# EAGLE design hbridge2 (EAGLE 7.1.0)
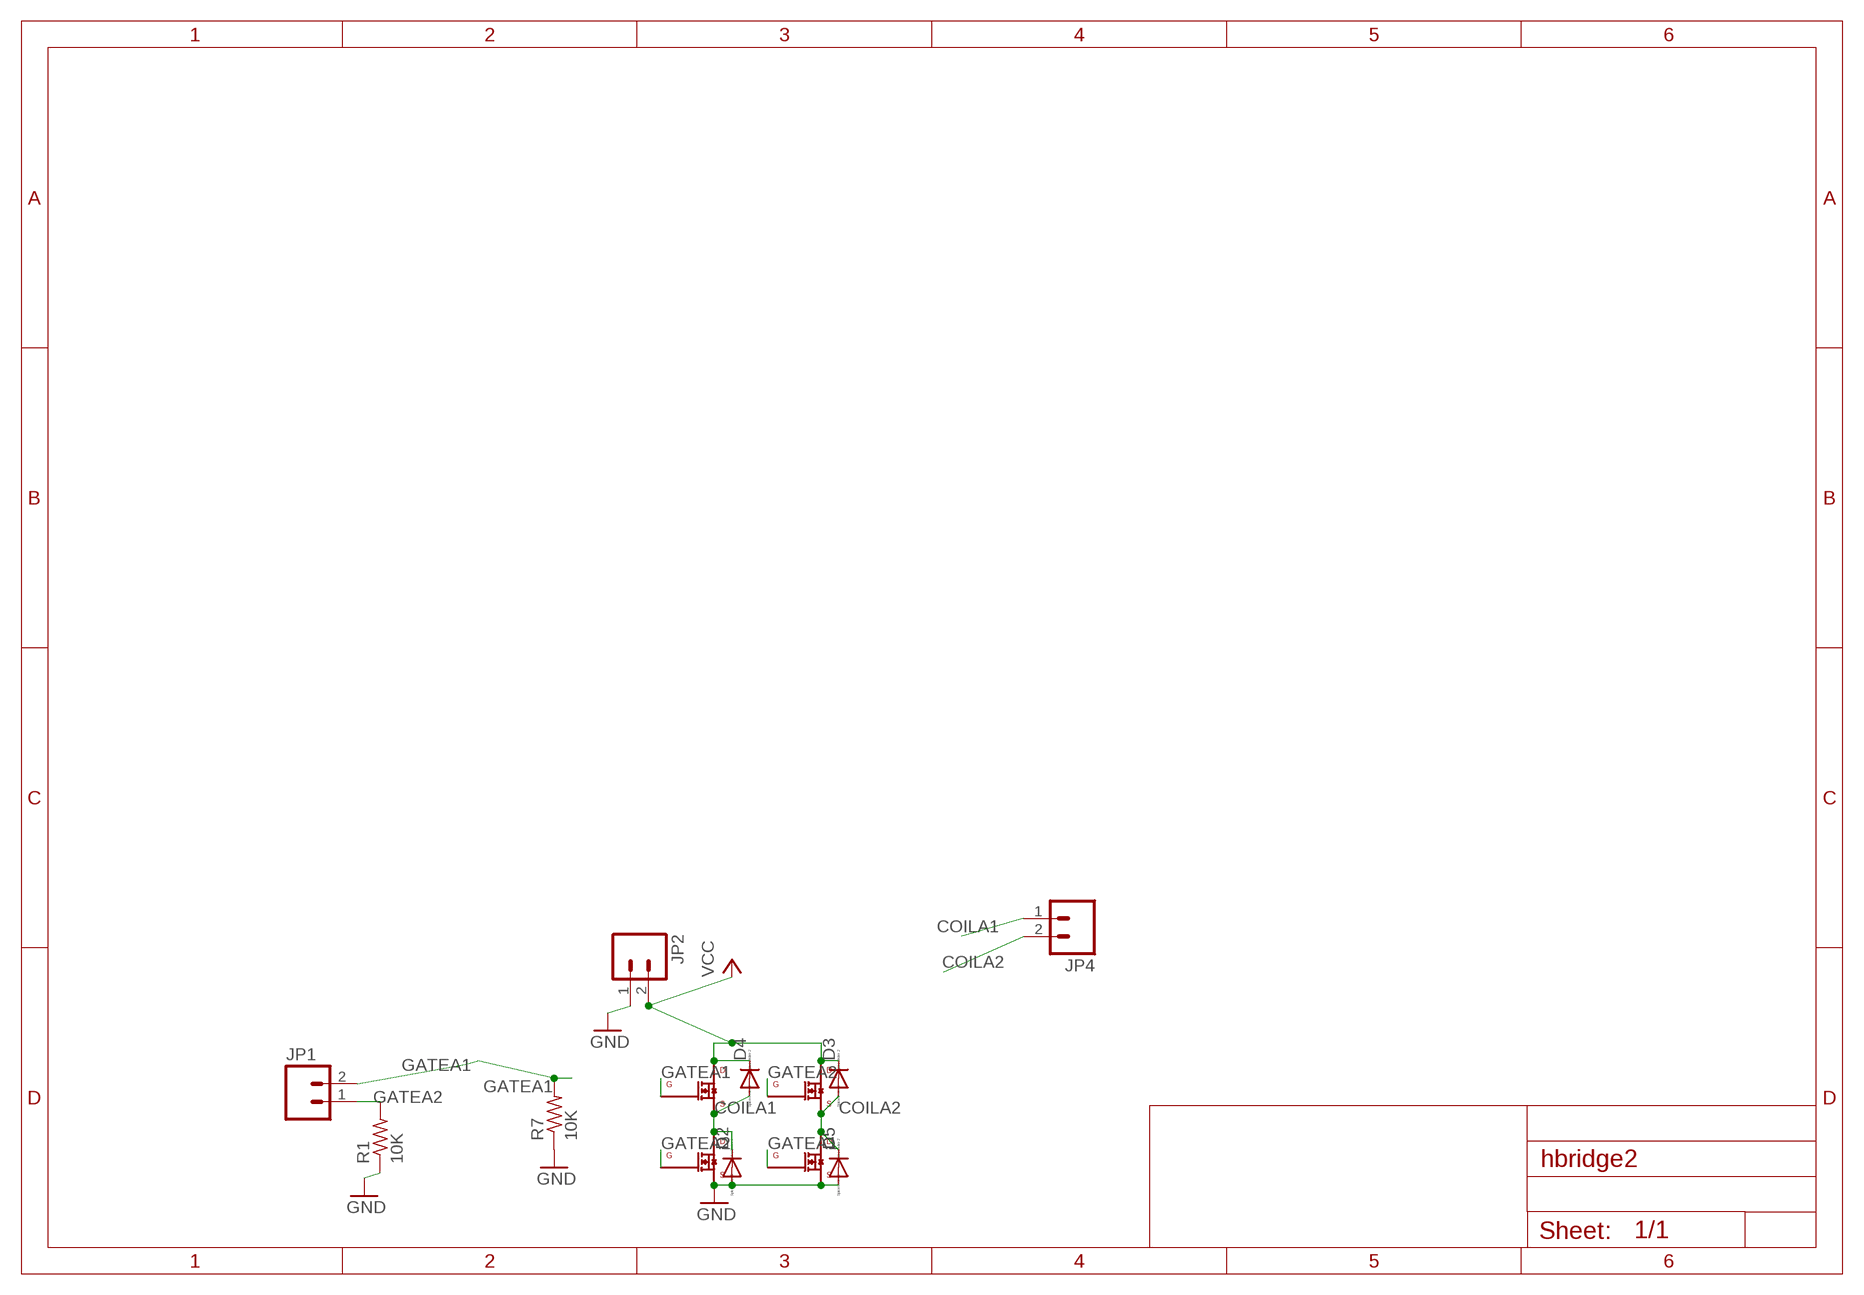
[diagram p0: schematic, sheet 1]

## Parts
D2  DIODE-DO-214AC  [DO-214AC]
D3  DIODE-DO-214AC  [DO-214AC]
D4  DIODE-DO-214AC  [DO-214AC]
D5  DIODE-DO-214AC  [DO-214AC]
JP1  M02PTH  [1X02]
JP2  M02PTH  [1X02]
JP4  M02PTH  [1X02]
Q2  IRLML0060  [SOT-23]
Q3  IRLML0060  [SOT-23]
Q4  IRLML0060  [SOT-23]
Q5  IRLML0060  [SOT-23]
R1  10K  R-US_R0603  [R0603]
R7  10K  R-US_R0603  [R0603]

## Nets
COILA1: D2.C D4.A JP4.1 Q2.3(DRAIN) Q4.2(SOURCE)
COILA2: D3.A D5.C JP4.2 Q3.2(SOURCE) Q5.3(DRAIN)
GATEA1: JP1.2 Q4.1(GATE) Q5.1(GATE) R7.2
GATEA2: JP1.1 Q2.1(GATE) Q3.1(GATE) R1.2
GND: D2.A D5.A JP2.1 Q2.2(SOURCE) Q5.2(SOURCE) R1.1 R7.1
VCC: D3.C D4.C JP2.2 Q3.3(DRAIN) Q4.3(DRAIN)

## Library data of the parts
D2-D5 = diode:DIODE-: DIODE
JP1 JP2 JP4 = SparkFun-Connectors:M02: Standard 2-pin 0.1" header. Use with - straight break away headers ( PRT-00116) - right angle break away headers (PRT-00553) - swiss pins (PRT-00743) - machine pins (PRT-00117) - female headers (PRT-00115) Molex polarized connector foot print use with: PRT-08233 with associated crimp pins and housings. 2.54_SCREWTERM for use with PRT-10571. 3.5mm Screw Terminal footprints for PRT-08084 5mm Screw Terminal footprints for use with PRT-08432
Q2-Q5 = spietz-library:IRLML0060
R1 R7 = resistor:R-US_: RESISTOR, American symbol

## Net classes
0 default: width 0.203 mm
1 vcc: width 0.254 mm

## Board
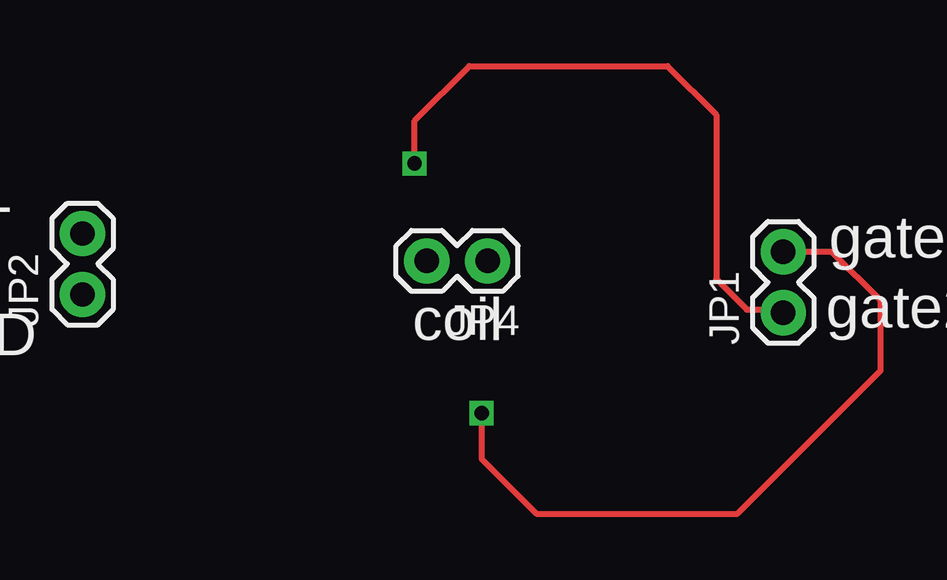
[diagram p1: board, top side]
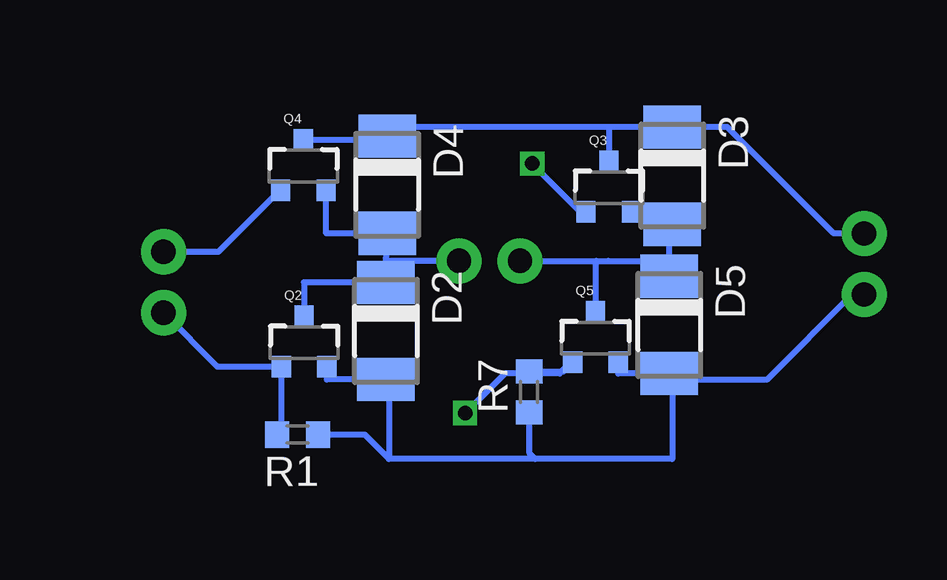
[diagram p2: board, bottom side, seen from below]

No outline drawn. Coordinates in mm, seen from the top.
Copper layers (1*16): Top 0.035mm / dielectric 1.5mm / Bottom 0.035mm
Design rules "default": minimum track width 10mil, minimum drill 24mil, track to track 8mil, track to pad 8mil, pad to pad 8mil, via to via 8mil, smd to smd 8mil, copper to edge 40mil, drill to drill 8mil, minimum pad ring 10mil, minimum via ring 8mil, stop-mask expansion 4mil, vias tented up to drill 0mil, thermal gap 10mil

### Footprints (pad centres in the part's own frame; a part is rotated, then mirrored left to right if it is on the bottom)
DO-214AC = smd 1.8 x 2.4: A 2.025,0; C -2.025,0
1X02 = drill 1.016 pad 1.88: 1 0,0; 2 2.54,0
SOT-23 = smd 0.8 x 0.9: 1 -0.95,-1; 2 0.95,-1; 3 0,1.1
R0603 = smd 1 x 1.1: 1 -0.85,0; 2 0.85,0

### Placement (x,y rotation side)
D2  80.26,13.34 270 bottom
D3  68.33,19.81 270 bottom
D4  80.21,19.43 270 bottom
D5  68.45,13.59 270 bottom
JP1  89.53,14.1 90 top
JP2  60.33,14.86 90 top
JP4  77.22,16.26 180 top
Q2  83.68,12.84 0 bottom
Q3  70.97,19.3 0 bottom
Q4  83.71,20.21 0 bottom
Q5  71.53,13.04 0 bottom
R1  83.95,9.02 180 bottom
R7  74.3,10.79 90 bottom

### Tracks (layer width: path | path; a pad name or v marks a point on that pad's centre or on a via)
COILA1
  Bottom 0.254: 80.26,16.26 D2.C 83.68,15.36 Q2.3 | Q4.2 82.76,17.41 D4.A 80.26,17.41 80.26,16.38 80.26,16.26 | JP4.1 80.26,16.26
COILA2
  Bottom 0.254: D3.A 68.45,17.79 | 68.45,16.26 D5.C | Q5.3 71.5,14.14 71.5,16.26 | 71.5,16.26 70.99,16.26 68.45,16.26 | 68.45,16.26 68.45,17.79 | Q3.2 68.45,18.18 68.45,17.79 | JP4.2 71.5,16.26
GATEA1  (via drill 0.6)
  Top 0.254: v76.96,9.91 76.96,8 79.25,5.71 87.63,5.71 93.6,11.68 93.6,14.61 91.57,16.64 JP1.2
  Bottom 0.254: Q4.1 84.68,19.21 87.25,16.64 JP1.2 | R7.2 72.87,11.64 Q5.1 72.55,12.04 73.03,11.56 75.31,11.56 v76.96,9.91
GATEA2  (via drill 0.6)
  Top 0.254: v74.17,20.32 74.17,22.1 76.45,24.38 84.71,24.38 86.74,22.35 86.74,15.49 88.01,14.22 89.41,14.22 JP1.1
  Bottom 0.254: R1.2 84.63,9.19 Q2.1 87.28,11.84 JP1.1 | Q3.1 72.15,18.3 v74.17,20.32
GND
  Bottom 0.254: D5.A 70.58,11.56 Q5.2 | Q2.2 82.73,11.31 D2.A 80.14,11.31 80.14,8 | D5.A 68.45,11.31 68.33,11.31 68.33,8 74.04,8 | 74.04,8 80.14,8 | JP2.1 60.83,14.86 64.39,11.3 68.19,11.3 D5.A | R7.1 74.3,8.26 74.04,8 | R1.1 81.15,9.02 80.14,8
VCC
  Bottom 0.254: 70.97,21.84 D3.C 66.04,21.84 61.59,17.4 JP2.2 | 70.97,21.84 Q3.3 | 70.97,21.84 80.21,21.84 D4.C 80.21,21.31 Q4.3 83.71,21.46

### Text on the board
tPlace: + | gate1 | coil | GND | gate2